# Altium schematic sheet 55. SOC PMIC.SchDoc: PMIC (part 3 of 3)
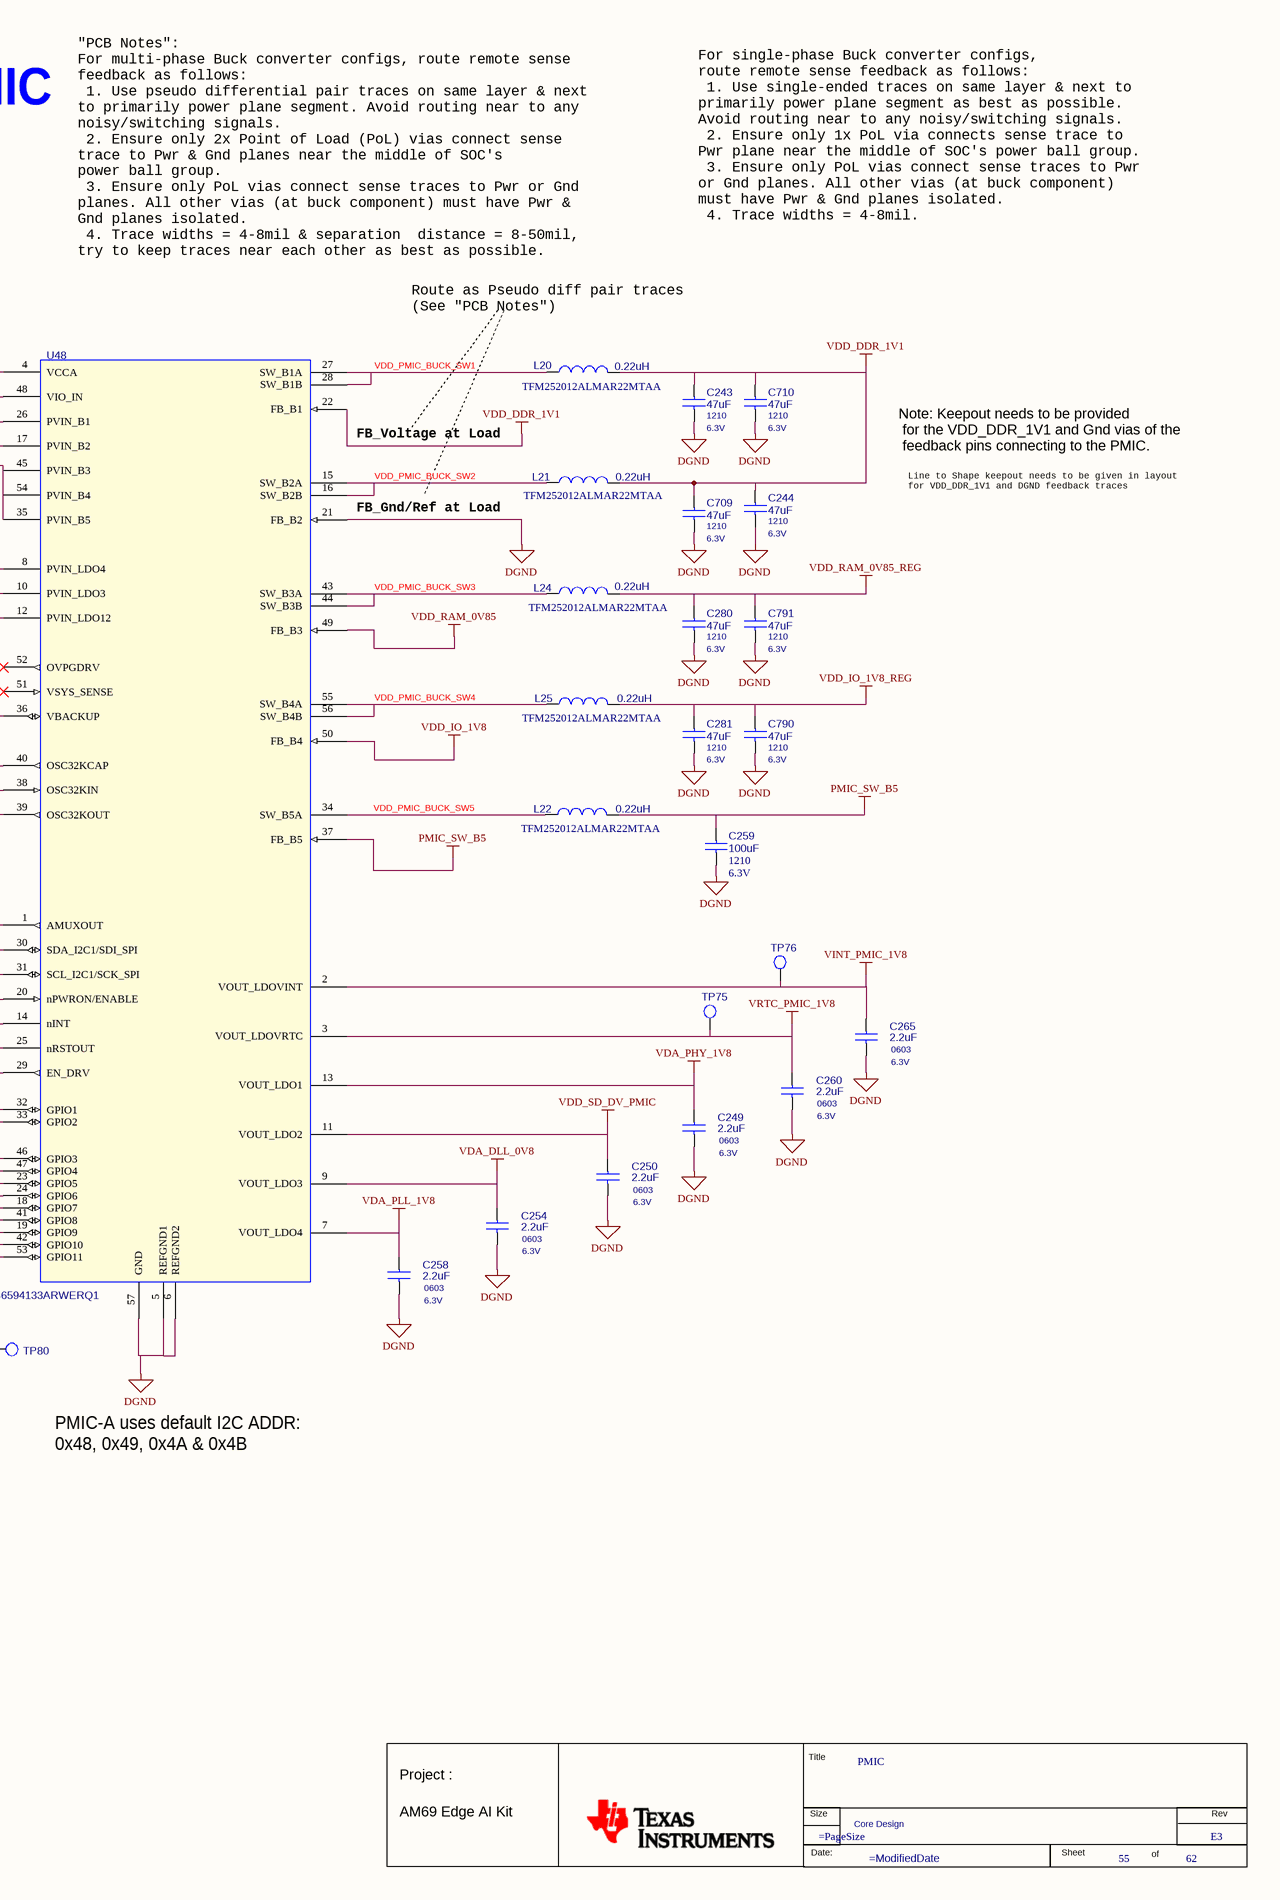
[diagram p3: 55. SOC PMIC.SchDoc, right]

## Library data of the parts (continued)
R251 = RESISTOR_Dup2: RES 1K 1/10W 1% 0402; Part Reference: R251; Part_type: RESISTORS\FIXED; Mfr_part_number: ERJ-2RKF1001X; Mfr_name: PANASONIC-ECG; Mistral Part No: 110009030411-R; Voltage: NA; Project: VOCERA; Customs_HS_Code: 85332119; Custom_Duty: 15%; Value: 1K_1%; PCB Footprint: RES0402_0-5; Footprint Path: Y:\MIS_DATABASE\Library\ALTIUM_TOOL\PCB_FOOTPRINTS\Altium_Footprint_Lib.PcbLib; Crtd /date: MAZHAR/150506; Datasheet: Y:\MIS_DATABASE\DATASHEETS\RESISTORS\PAN-ERJSER_NOV17.PDF; Temperature: -55°C+155°C; Weight: 0.8mg; Height: 0.40MM; Distributor_part_number: P1.00KLCT-ND; Distributor_name: DIGIKEY; Package: 0402; Wattage: 1/10W; Tolerance: 1%; Library Ref: RESISTOR; Footprint Ref: RES0402_0-5; Chkd/date: VASANTHA/281216; MECHANICAL 3D STEP FILE: RES0402_0-5; Library Path: Y:\MIS_DATABASE\Library\ALTIUM_TOOL\SCHEMATICS_PARTS\MS_DISCRETE_Library.schlib; Manufacturer: PANASONIC-ECG
R252 = RESISTOR_Dup2: RES 10K 1/16W 1% 0402; Part Reference: R252; Manufacturer: YAGEO AMERICA; Mistral Part No: 110015090015-R; Mfr_part_number: RC0402FR-0710KL; Part_type: RESISTORS\FIXED; Project: VOCERA; Voltage: NA; Customs_HS_Code: 85332119; Custom_Duty: 15%; Value: 10K_1%; PCB Footprint: RES0402_0-5; Footprint Ref: RES0402_0-5; Mfr_name: YAGEO AMERICA; Tolerance: 1%; Wattage: 1/16W; Distributor_name: DIGIKEY; Distributor_part_number: 311-10.0KLRTR-ND; Library Ref: RESISTOR; Height: 0.40MM; Weight: 0.65mg; Temperature: -55°C+155°C; Datasheet: Y:\MIS_DATABASE\DATASHEETS\RESISTORS\RCXXXXL-SER_MAR18.PDF; Crtd /date: GEETHA/290506; Chkd/date: VASANTHA/201216; MECHANICAL 3D STEP FILE: RES0402_0-5; Library Path: Y:\MIS_DATABASE\Library\ALTIUM_TOOL\SCHEMATICS_PARTS\MS_DISCRETE_Library.schlib; Footprint Path: Y:\MIS_DATABASE\Library\ALTIUM_TOOL\PCB_FOOTPRINTS\Altium_Footprint_Lib.PcbLib
R498 = RESISTOR_Dup2: RES 10K 1/16W 1% 0402; Part Reference: R498; Mistral Part No: 110015090015-R; Mfr_name: YAGEO AMERICA; Mfr_part_number: RC0402FR-0710KL; Part_type: RESISTORS\FIXED; Project: VOCERA; Voltage: NA; Customs_HS_Code: 85332119; Custom_Duty: 15%; Value: 10K_1%; PCB Footprint: RES0402_0-5; Footprint Ref: RES0402_0-5; Tolerance: 1%; Wattage: 1/16W; Distributor_name: DIGIKEY; Distributor_part_number: 311-10.0KLRTR-ND; Library Ref: RESISTOR; Height: 0.40MM; Weight: 0.65mg; Temperature: -55°C+155°C; Datasheet: Y:\MIS_DATABASE\DATASHEETS\RESISTORS\RCXXXXL-SER_MAR18.PDF; Crtd /date: GEETHA/290506; Chkd/date: VASANTHA/201216; MECHANICAL 3D STEP FILE: RES0402_0-5; Library Path: Y:\MIS_DATABASE\Library\ALTIUM_TOOL\SCHEMATICS_PARTS\MS_DISCRETE_Library.schlib; Footprint Path: Y:\MIS_DATABASE\Library\ALTIUM_TOOL\PCB_FOOTPRINTS\Altium_Footprint_Lib.PcbLib; Manufacturer: YAGEO AMERICA
R502 = RESISTOR_Dup2: RES 0E 1/10W JUMPER 0402; Part Reference: R502; Manufacturer: PANASONIC-ECG; Part_type: RESISTORS\FIXED; Mfr_part_number: ERJ-2GE0R00X; Mistral Part No: 110018030052-R; IBISSP_MODLES: VALUE REPEATING 2 TIME; Custom_Duty: 15%; Customs_HS_Code: 85332119; Voltage: NA; Project: AEGIS POM; Value: 0E; Footprint Path: Y:\MIS_DATABASE\Library\ALTIUM_TOOL\PCB_FOOTPRINTS\Altium_Footprint_Lib.PcbLib; MECHANICAL 3D STEP FILE: RES0402_0-5; Chkd/date: VASANTHA/061216; Crtd /date: NAVEED/201014; Datasheet: Y:\MIS_DATABASE\DATASHEETS\RESISTORS\PAN-ERJSER_NOV17.PDF; Temperature: -55°C+155°C; Weight: 0.8mg; Height: 0.40MM; Library Ref: RESISTOR; Distributor_part_number: P0.0JCT-ND; Distributor_name: DIGIKEY; Package: 0402; Wattage: 1/10W; Tolerance: NA; Mfr_name: PANASONIC-ECG; Footprint Ref: RES0402_0-5; Library Path: Y:\MIS_DATABASE\Library\ALTIUM_TOOL\SCHEMATICS_PARTS\MS_DISCRETE_Library.schlib; PCB Footprint: RES0402_0-5
R505 = RESISTOR_Dup2: RES 0E 1/10W JUMPER 0402; Part Reference: R505; Part_type: RESISTORS\FIXED; Mfr_part_number: ERJ-2GE0R00X; Mfr_name: PANASONIC-ECG; Mistral Part No: 110018030052-R; Custom_Duty: 15%; Customs_HS_Code: 85332119; Voltage: NA; Project: AEGIS POM; IBISSP_MODLES: VALUE REPEATING 2 TIME; Value: 0E; Footprint Path: Y:\MIS_DATABASE\Library\ALTIUM_TOOL\PCB_FOOTPRINTS\Altium_Footprint_Lib.PcbLib; MECHANICAL 3D STEP FILE: RES0402_0-5; Chkd/date: VASANTHA/061216; Crtd /date: NAVEED/201014; Datasheet: Y:\MIS_DATABASE\DATASHEETS\RESISTORS\PAN-ERJSER_NOV17.PDF; Temperature: -55°C+155°C; Weight: 0.8mg; Height: 0.40MM; Library Ref: RESISTOR; Distributor_part_number: P0.0JCT-ND; Distributor_name: DIGIKEY; Package: 0402; Wattage: 1/10W; Tolerance: NA; Footprint Ref: RES0402_0-5; Library Path: Y:\MIS_DATABASE\Library\ALTIUM_TOOL\SCHEMATICS_PARTS\MS_DISCRETE_Library.schlib; PCB Footprint: RES0402_0-5; Manufacturer: PANASONIC-ECG
R506 = RESISTOR_Dup2: RES 0E 1/10W JUMPER 0402; Part Reference: R506; Mistral Part No: 110018030052-R; Mfr_name: PANASONIC-ECG; Mfr_part_number: ERJ-2GE0R00X; Part_type: RESISTORS\FIXED; Project: AEGIS POM; Tolerance: NA; Customs_HS_Code: 85332119; Custom_Duty: 15%; IBISSP_MODLES: VALUE REPEATING 2 TIME; Value: 0E; Library Path: Y:\MIS_DATABASE\Library\ALTIUM_TOOL\SCHEMATICS_PARTS\MS_DISCRETE_Library.schlib; Footprint Ref: RES0402_0-5; Voltage: NA; Wattage: 1/10W; Package: 0402; Distributor_name: DIGIKEY; Distributor_part_number: P0.0JCT-ND; Library Ref: RESISTOR; Height: 0.40MM; Weight: 0.8mg; Temperature: -55°C+155°C; Datasheet: Y:\MIS_DATABASE\DATASHEETS\RESISTORS\PAN-ERJSER_NOV17.PDF; Crtd /date: NAVEED/201014; Chkd/date: VASANTHA/061216; MECHANICAL 3D STEP FILE: RES0402_0-5; Footprint Path: Y:\MIS_DATABASE\Library\ALTIUM_TOOL\PCB_FOOTPRINTS\Altium_Footprint_Lib.PcbLib; Manufacturer: PANASONIC-ECG; PCB Footprint: RES0402_0-5
R507 = RESISTOR_Dup2: RES 0E 1/10W JUMPER 0402; Part Reference: R507; Mistral Part No: 110018030052-R; Mfr_name: PANASONIC-ECG; Mfr_part_number: ERJ-2GE0R00X; Part_type: RESISTORS\FIXED; Project: AEGIS POM; Tolerance: NA; Customs_HS_Code: 85332119; Custom_Duty: 15%; IBISSP_MODLES: VALUE REPEATING 2 TIME; Value: 0E; Library Path: Y:\MIS_DATABASE\Library\ALTIUM_TOOL\SCHEMATICS_PARTS\MS_DISCRETE_Library.schlib; Footprint Ref: RES0402_0-5; Voltage: NA; Wattage: 1/10W; Package: 0402; Distributor_name: DIGIKEY; Distributor_part_number: P0.0JCT-ND; Library Ref: RESISTOR; Height: 0.40MM; Weight: 0.8mg; Temperature: -55°C+155°C; Datasheet: Y:\MIS_DATABASE\DATASHEETS\RESISTORS\PAN-ERJSER_NOV17.PDF; Crtd /date: NAVEED/201014; Chkd/date: VASANTHA/061216; MECHANICAL 3D STEP FILE: RES0402_0-5; Footprint Path: Y:\MIS_DATABASE\Library\ALTIUM_TOOL\PCB_FOOTPRINTS\Altium_Footprint_Lib.PcbLib; Manufacturer: PANASONIC-ECG; PCB Footprint: RES0402_0-5
R513 = RESISTOR_Dup2: RES 0E 1/10W JUMPER 0402; Part Reference: R513; Mistral Part No: 110018030052-R; Mfr_name: PANASONIC-ECG; Mfr_part_number: ERJ-2GE0R00X; Part_type: RESISTORS\FIXED; Project: AEGIS POM; Tolerance: NA; Customs_HS_Code: 85332119; Custom_Duty: 15%; IBISSP_MODLES: VALUE REPEATING 2 TIME; Value: 0E; Library Path: Y:\MIS_DATABASE\Library\ALTIUM_TOOL\SCHEMATICS_PARTS\MS_DISCRETE_Library.schlib; Footprint Ref: RES0402_0-5; Voltage: NA; Wattage: 1/10W; Package: 0402; Distributor_name: DIGIKEY; Distributor_part_number: P0.0JCT-ND; Library Ref: RESISTOR; Height: 0.40MM; Weight: 0.8mg; Temperature: -55°C+155°C; Datasheet: Y:\MIS_DATABASE\DATASHEETS\RESISTORS\PAN-ERJSER_NOV17.PDF; Crtd /date: NAVEED/201014; Chkd/date: VASANTHA/061216; MECHANICAL 3D STEP FILE: RES0402_0-5; Footprint Path: Y:\MIS_DATABASE\Library\ALTIUM_TOOL\PCB_FOOTPRINTS\Altium_Footprint_Lib.PcbLib; Manufacturer: PANASONIC-ECG; PCB Footprint: RES0402_0-5
R515 = RESISTOR_Dup2: RES 10K 1/16W 1% 0402; Part Reference: R515; Manufacturer: YAGEO AMERICA; Part_type: RESISTORS\FIXED; Mfr_part_number: RC0402FR-0710KL; Mistral Part No: 110015090015-R; Custom_Duty: 15%; Customs_HS_Code: 85332119; Voltage: NA; Project: VOCERA; Value: 10K_1%; Footprint Path: Y:\MIS_DATABASE\Library\ALTIUM_TOOL\PCB_FOOTPRINTS\Altium_Footprint_Lib.PcbLib; Library Path: Y:\MIS_DATABASE\Library\ALTIUM_TOOL\SCHEMATICS_PARTS\MS_DISCRETE_Library.schlib; MECHANICAL 3D STEP FILE: RES0402_0-5; Chkd/date: VASANTHA/201216; Crtd /date: GEETHA/290506; Datasheet: Y:\MIS_DATABASE\DATASHEETS\RESISTORS\RCXXXXL-SER_MAR18.PDF; Temperature: -55°C+155°C; Weight: 0.65mg; Height: 0.40MM; Library Ref: RESISTOR; Distributor_part_number: 311-10.0KLRTR-ND; Distributor_name: DIGIKEY; Wattage: 1/16W; Tolerance: 1%; Mfr_name: YAGEO AMERICA; Footprint Ref: RES0402_0-5; PCB Footprint: RES0402_0-5
R528 = RESISTOR_Dup2: RES 0E 1/10W JUMPER 0402; Part Reference: R528; Mistral Part No: 110018030052-R; Mfr_name: PANASONIC-ECG; Mfr_part_number: ERJ-2GE0R00X; Part_type: RESISTORS\FIXED; Project: AEGIS POM; Tolerance: NA; Customs_HS_Code: 85332119; Custom_Duty: 15%; IBISSP_MODLES: VALUE REPEATING 2 TIME; Value: 0E; PCB Footprint: RES0402_0-5; Library Path: Y:\MIS_DATABASE\Library\ALTIUM_TOOL\SCHEMATICS_PARTS\MS_DISCRETE_Library.schlib; Footprint Ref: RES0402_0-5; Voltage: NA; Wattage: 1/10W; Distributor_name: DIGIKEY; Distributor_part_number: P0.0JCT-ND; Library Ref: RESISTOR; Height: 0.40MM; Weight: 0.8mg; Temperature: -55°C+155°C; Datasheet: Y:\MIS_DATABASE\DATASHEETS\RESISTORS\PAN-ERJSER_NOV17.PDF; Crtd /date: NAVEED/201014; Chkd/date: VASANTHA/061216; MECHANICAL 3D STEP FILE: RES0402_0-5; Footprint Path: Y:\MIS_DATABASE\Library\ALTIUM_TOOL\PCB_FOOTPRINTS\Altium_Footprint_Lib.PcbLib; Manufacturer: PANASONIC-ECG
R529 = RESISTOR_Dup2: RES 10K 1/16W 1% 0402; Part Reference: R529; Manufacturer: YAGEO AMERICA; Mistral Part No: 110015090015-R; Mfr_part_number: RC0402FR-0710KL; Part_type: RESISTORS\FIXED; Project: VOCERA; Voltage: NA; Customs_HS_Code: 85332119; Custom_Duty: 15%; Value: 10K_1%; PCB Footprint: RES0402_0-5; Footprint Ref: RES0402_0-5; Mfr_name: YAGEO AMERICA; Tolerance: 1%; Wattage: 1/16W; Distributor_name: DIGIKEY; Distributor_part_number: 311-10.0KLRTR-ND; Library Ref: RESISTOR; Height: 0.40MM; Weight: 0.65mg; Temperature: -55°C+155°C; Datasheet: Y:\MIS_DATABASE\DATASHEETS\RESISTORS\RCXXXXL-SER_MAR18.PDF; Crtd /date: GEETHA/290506; Chkd/date: VASANTHA/201216; MECHANICAL 3D STEP FILE: RES0402_0-5; Library Path: Y:\MIS_DATABASE\Library\ALTIUM_TOOL\SCHEMATICS_PARTS\MS_DISCRETE_Library.schlib; Footprint Path: Y:\MIS_DATABASE\Library\ALTIUM_TOOL\PCB_FOOTPRINTS\Altium_Footprint_Lib.PcbLib
R532 = RESISTOR_Dup2: RES 0E 1/10W JUMPER 0402; Part Reference: R532; Part_type: RESISTORS\FIXED; Mfr_part_number: ERJ-2GE0R00X; Mfr_name: PANASONIC-ECG; Mistral Part No: 110018030052-R; Custom_Duty: 15%; Customs_HS_Code: 85332119; Voltage: NA; Project: AEGIS POM; IBISSP_MODLES: VALUE REPEATING 2 TIME; Value: 0E; Footprint Path: Y:\MIS_DATABASE\Library\ALTIUM_TOOL\PCB_FOOTPRINTS\Altium_Footprint_Lib.PcbLib; MECHANICAL 3D STEP FILE: RES0402_0-5; Chkd/date: VASANTHA/061216; Crtd /date: NAVEED/201014; Datasheet: Y:\MIS_DATABASE\DATASHEETS\RESISTORS\PAN-ERJSER_NOV17.PDF; Temperature: -55°C+155°C; Weight: 0.8mg; Height: 0.40MM; Library Ref: RESISTOR; Distributor_part_number: P0.0JCT-ND; Distributor_name: DIGIKEY; Wattage: 1/10W; Tolerance: NA; Footprint Ref: RES0402_0-5; Library Path: Y:\MIS_DATABASE\Library\ALTIUM_TOOL\SCHEMATICS_PARTS\MS_DISCRETE_Library.schlib; Manufacturer: PANASONIC-ECG; PCB Footprint: RES0402_0-5
R540 = RESISTOR_Dup2: RES 0E 1/10W JUMPER 0402; Part Reference: R540; Manufacturer: PANASONIC-ECG; Part_type: RESISTORS\FIXED; Mfr_part_number: ERJ-2GE0R00X; Mistral Part No: 110018030052-R; IBISSP_MODLES: VALUE REPEATING 2 TIME; Custom_Duty: 15%; Customs_HS_Code: 85332119; Voltage: NA; Project: AEGIS POM; Value: 0E; PCB Footprint: RES0402_0-5; Footprint Path: Y:\MIS_DATABASE\Library\ALTIUM_TOOL\PCB_FOOTPRINTS\Altium_Footprint_Lib.PcbLib; MECHANICAL 3D STEP FILE: RES0402_0-5; Chkd/date: VASANTHA/061216; Crtd /date: NAVEED/201014; Datasheet: Y:\MIS_DATABASE\DATASHEETS\RESISTORS\PAN-ERJSER_NOV17.PDF; Temperature: -55°C+155°C; Weight: 0.8mg; Height: 0.40MM; Library Ref: RESISTOR; Distributor_part_number: P0.0JCT-ND; Distributor_name: DIGIKEY; Package: 0402; Wattage: 1/10W; Tolerance: NA; Mfr_name: PANASONIC-ECG; Footprint Ref: RES0402_0-5; Library Path: Y:\MIS_DATABASE\Library\ALTIUM_TOOL\SCHEMATICS_PARTS\MS_DISCRETE_Library.schlib
TP60 = TESTPOINT_Dup1: TESTPOINT CIR 30 SMD; Part Reference: TP60; Mistral Part No: 130009030930; Mfr_name: LOCAL; Project: BT MODULE_CSRBC04; Tolerance: NA; Value: TP30_SMD; Footprint Ref: TP30_SMD; Mfr_part_number: TP30_SMD; Part_type: TESTPOINT; Voltage: NA; Wattage: NA; Package: SMD; Distributor_name: NA; Distributor_part_number: NA; Library Ref: TESTPOINT; Height: NA; Weight: NA; Temperature: NA; Datasheet: NA; Crtd /date: MAZHAR/171006; Chkd/date: SHREESHAIL/171006; RoHS: NA; Customs_HS_Code: NA; Custom_Duty: NA; MECHANICAL 3D STEP FILE: NA; Library Path: Y:\MIS_DATABASE\Library\ALTIUM_TOOL\SCHEMATICS_PARTS\MS_DISCRETE_Library.schlib; Footprint Path: Y:\MIS_DATABASE\Library\ALTIUM_TOOL\PCB_FOOTPRINTS\Altium_Footprint_Lib.PcbLib; PCB Footprint: TP30_SMD; Manufacturer: LOCAL
TP62 = TESTPOINT_Dup1: TESTPOINT CIR 30 SMD; Part Reference: TP62; Manufacturer: LOCAL; Mistral Part No: 130009030930; MECHANICAL 3D STEP FILE: NA; Project: BT MODULE_CSRBC04; Value: TP30_SMD; PCB Footprint: TP30_SMD; Footprint Path: Y:\MIS_DATABASE\Library\ALTIUM_TOOL\PCB_FOOTPRINTS\Altium_Footprint_Lib.PcbLib; Library Path: Y:\MIS_DATABASE\Library\ALTIUM_TOOL\SCHEMATICS_PARTS\MS_DISCRETE_Library.schlib; Custom_Duty: NA; Customs_HS_Code: NA; RoHS: NA; Chkd/date: SHREESHAIL/171006; Crtd /date: MAZHAR/171006; Datasheet: NA; Temperature: NA; Weight: NA; Height: NA; Library Ref: TESTPOINT; Distributor_part_number: NA; Distributor_name: NA; Package: SMD; Wattage: NA; Voltage: NA; Tolerance: NA; Part_type: TESTPOINT; Mfr_part_number: TP30_SMD; Mfr_name: LOCAL; Footprint Ref: TP30_SMD
TP64 = TESTPOINT_Dup1: TESTPOINT CIR 30 SMD; Part Reference: TP64; Manufacturer: LOCAL; Mistral Part No: 130009030930; Project: BT MODULE_CSRBC04; Tolerance: NA; Value: TP30_SMD; Footprint Ref: TP30_SMD; Mfr_name: LOCAL; Mfr_part_number: TP30_SMD; Part_type: TESTPOINT; Voltage: NA; Wattage: NA; Package: SMD; Distributor_name: NA; Distributor_part_number: NA; Library Ref: TESTPOINT; Height: NA; Weight: NA; Temperature: NA; Datasheet: NA; Crtd /date: MAZHAR/171006; Chkd/date: SHREESHAIL/171006; RoHS: NA; Customs_HS_Code: NA; Custom_Duty: NA; MECHANICAL 3D STEP FILE: NA; Library Path: Y:\MIS_DATABASE\Library\ALTIUM_TOOL\SCHEMATICS_PARTS\MS_DISCRETE_Library.schlib; Footprint Path: Y:\MIS_DATABASE\Library\ALTIUM_TOOL\PCB_FOOTPRINTS\Altium_Footprint_Lib.PcbLib; PCB Footprint: TP30_SMD
TP68 = TESTPOINT_Dup1: TESTPOINT CIR 30 SMD; Part Reference: TP68; Mfr_name: LOCAL; Mistral Part No: 130009030930; MECHANICAL 3D STEP FILE: NA; Project: BT MODULE_CSRBC04; Value: TP30_SMD; PCB Footprint: TP30_SMD; RoHS: NA; Footprint Path: Y:\MIS_DATABASE\Library\ALTIUM_TOOL\PCB_FOOTPRINTS\Altium_Footprint_Lib.PcbLib; Library Path: Y:\MIS_DATABASE\Library\ALTIUM_TOOL\SCHEMATICS_PARTS\MS_DISCRETE_Library.schlib; Chkd/date: SHREESHAIL/171006; Crtd /date: MAZHAR/171006; Datasheet: NA; Temperature: NA; Weight: NA; Height: NA; Distributor_part_number: NA; Distributor_name: NA; Package: SMD; Wattage: NA; Voltage: NA; Tolerance: NA; Part_type: TESTPOINT; Mfr_part_number: TP30_SMD; Library Ref: TESTPOINT; Footprint Ref: TP30_SMD; Customs_HS_Code: NA; Custom_Duty: NA; Manufacturer: LOCAL
TP69 = TESTPOINT_Dup1: TESTPOINT CIR 30 SMD; Part Reference: TP69; Mfr_name: LOCAL; Mistral Part No: 130009030930; MECHANICAL 3D STEP FILE: NA; Project: BT MODULE_CSRBC04; Value: TP30_SMD; Footprint Path: Y:\MIS_DATABASE\Library\ALTIUM_TOOL\PCB_FOOTPRINTS\Altium_Footprint_Lib.PcbLib; Library Path: Y:\MIS_DATABASE\Library\ALTIUM_TOOL\SCHEMATICS_PARTS\MS_DISCRETE_Library.schlib; Custom_Duty: NA; Customs_HS_Code: NA; RoHS: NA; Chkd/date: SHREESHAIL/171006; Crtd /date: MAZHAR/171006; Datasheet: NA; Temperature: NA; Weight: NA; Height: NA; Library Ref: TESTPOINT; Distributor_part_number: NA; Distributor_name: NA; Package: SMD; Wattage: NA; Voltage: NA; Tolerance: NA; Part_type: TESTPOINT; Mfr_part_number: TP30_SMD; Footprint Ref: TP30_SMD; Manufacturer: LOCAL; PCB Footprint: TP30_SMD
TP70 = TESTPOINT_Dup1: TESTPOINT CIR 30 SMD; Part Reference: TP70; Manufacturer: LOCAL; Mistral Part No: 130009030930; MECHANICAL 3D STEP FILE: NA; Project: BT MODULE_CSRBC04; Value: TP30_SMD; Footprint Path: Y:\MIS_DATABASE\Library\ALTIUM_TOOL\PCB_FOOTPRINTS\Altium_Footprint_Lib.PcbLib; Library Path: Y:\MIS_DATABASE\Library\ALTIUM_TOOL\SCHEMATICS_PARTS\MS_DISCRETE_Library.schlib; Custom_Duty: NA; Customs_HS_Code: NA; RoHS: NA; Chkd/date: SHREESHAIL/171006; Crtd /date: MAZHAR/171006; Datasheet: NA; Temperature: NA; Weight: NA; Height: NA; Library Ref: TESTPOINT; Distributor_part_number: NA; Distributor_name: NA; Package: SMD; Wattage: NA; Voltage: NA; Tolerance: NA; Part_type: TESTPOINT; Mfr_part_number: TP30_SMD; Mfr_name: LOCAL; Footprint Ref: TP30_SMD; PCB Footprint: TP30_SMD
TP75 = TESTPOINT_Dup1: TESTPOINT CIR 30 SMD; Part Reference: TP75; Mfr_name: LOCAL; Mistral Part No: 130009030930; MECHANICAL 3D STEP FILE: NA; Project: BT MODULE_CSRBC04; Value: TP30_SMD; Footprint Path: Y:\MIS_DATABASE\Library\ALTIUM_TOOL\PCB_FOOTPRINTS\Altium_Footprint_Lib.PcbLib; Library Path: Y:\MIS_DATABASE\Library\ALTIUM_TOOL\SCHEMATICS_PARTS\MS_DISCRETE_Library.schlib; Custom_Duty: NA; Customs_HS_Code: NA; RoHS: NA; Chkd/date: SHREESHAIL/171006; Crtd /date: MAZHAR/171006; Datasheet: NA; Temperature: NA; Weight: NA; Height: NA; Library Ref: TESTPOINT; Distributor_part_number: NA; Distributor_name: NA; Package: SMD; Wattage: NA; Voltage: NA; Tolerance: NA; Part_type: TESTPOINT; Mfr_part_number: TP30_SMD; Footprint Ref: TP30_SMD; PCB Footprint: TP30_SMD; Manufacturer: LOCAL
TP76 = TESTPOINT_Dup1: TESTPOINT CIR 30 SMD; Part Reference: TP76; Mistral Part No: 130009030930; Mfr_name: LOCAL; Project: BT MODULE_CSRBC04; Tolerance: NA; Value: TP30_SMD; Footprint Ref: TP30_SMD; Mfr_part_number: TP30_SMD; Part_type: TESTPOINT; Voltage: NA; Wattage: NA; Package: SMD; Distributor_name: NA; Distributor_part_number: NA; Library Ref: TESTPOINT; Height: NA; Weight: NA; Temperature: NA; Datasheet: NA; Crtd /date: MAZHAR/171006; Chkd/date: SHREESHAIL/171006; RoHS: NA; Customs_HS_Code: NA; Custom_Duty: NA; MECHANICAL 3D STEP FILE: NA; Library Path: Y:\MIS_DATABASE\Library\ALTIUM_TOOL\SCHEMATICS_PARTS\MS_DISCRETE_Library.schlib; Footprint Path: Y:\MIS_DATABASE\Library\ALTIUM_TOOL\PCB_FOOTPRINTS\Altium_Footprint_Lib.PcbLib; PCB Footprint: TP30_SMD; Manufacturer: LOCAL
TP78 = TESTPOINT_Dup1: TESTPOINT CIR 30 SMD; Part Reference: TP78; Manufacturer: LOCAL; Mistral Part No: 130009030930; Custom_Duty: NA; Project: BT MODULE_CSRBC04; Value: TP30_SMD; PCB Footprint: TP30_SMD; Customs_HS_Code: NA; Footprint Ref: TP30_SMD; Library Ref: TESTPOINT; Mfr_name: LOCAL; Mfr_part_number: TP30_SMD; Part_type: TESTPOINT; Tolerance: NA; Voltage: NA; Wattage: NA; Package: SMD; Distributor_name: NA; Distributor_part_number: NA; Height: NA; Weight: NA; Temperature: NA; Datasheet: NA; Crtd /date: MAZHAR/171006; Chkd/date: SHREESHAIL/171006; MECHANICAL 3D STEP FILE: NA; Library Path: Y:\MIS_DATABASE\Library\ALTIUM_TOOL\SCHEMATICS_PARTS\MS_DISCRETE_Library.schlib; Footprint Path: Y:\MIS_DATABASE\Library\ALTIUM_TOOL\PCB_FOOTPRINTS\Altium_Footprint_Lib.PcbLib; RoHS: NA
TP79 = TESTPOINT_Dup1: TESTPOINT CIR 30 SMD; Part Reference: TP79; Manufacturer: LOCAL; Mistral Part No: 130009030930; Project: BT MODULE_CSRBC04; Tolerance: NA; Value: TP30_SMD; PCB Footprint: TP30_SMD; Footprint Ref: TP30_SMD; Mfr_name: LOCAL; Mfr_part_number: TP30_SMD; Part_type: TESTPOINT; Voltage: NA; Wattage: NA; Package: SMD; Distributor_name: NA; Distributor_part_number: NA; Library Ref: TESTPOINT; Height: NA; Weight: NA; Temperature: NA; Datasheet: NA; Crtd /date: MAZHAR/171006; Chkd/date: SHREESHAIL/171006; RoHS: NA; Customs_HS_Code: NA; Custom_Duty: NA; MECHANICAL 3D STEP FILE: NA; Library Path: Y:\MIS_DATABASE\Library\ALTIUM_TOOL\SCHEMATICS_PARTS\MS_DISCRETE_Library.schlib; Footprint Path: Y:\MIS_DATABASE\Library\ALTIUM_TOOL\PCB_FOOTPRINTS\Altium_Footprint_Lib.PcbLib
TP80 = TESTPOINT_Dup1: TESTPOINT CIR 30 SMD; Part Reference: TP80; Mistral Part No: 130009030930; Mfr_name: LOCAL; Project: BT MODULE_CSRBC04; Tolerance: NA; Value: TP30_SMD; Footprint Ref: TP30_SMD; Mfr_part_number: TP30_SMD; Part_type: TESTPOINT; Voltage: NA; Wattage: NA; Package: SMD; Distributor_name: NA; Distributor_part_number: NA; Library Ref: TESTPOINT; Height: NA; Weight: NA; Temperature: NA; Datasheet: NA; Crtd /date: MAZHAR/171006; Chkd/date: SHREESHAIL/171006; RoHS: NA; Customs_HS_Code: NA; Custom_Duty: NA; MECHANICAL 3D STEP FILE: NA; Library Path: Y:\MIS_DATABASE\Library\ALTIUM_TOOL\SCHEMATICS_PARTS\MS_DISCRETE_Library.schlib; Footprint Path: Y:\MIS_DATABASE\Library\ALTIUM_TOOL\PCB_FOOTPRINTS\Altium_Footprint_Lib.PcbLib; PCB Footprint: TP30_SMD; Manufacturer: LOCAL
U48 = TPS65941-Q1_VQFN56: IC POWER MANAGEMENT WITH 4-PHASE 14A BUCK VQFN56; Part Reference: U48; Manufacturer: TEXAS INSTRUMENTS; Mistral Part No: 142022030021-R; Part_type: ICS\POWER\MANAGEMENT; PCB Footprint: VQFN56_19-68_320X320_0-9_EP6; Remarks: CREATED SAME AS PTPS65941120RWERQ1; Project: TI_J7AHP_EVM_BRD; Tolerance: NA; Customs_HS_Code: 85423100; Custom_Duty: 15%; Value: TPS6594133ARWERQ1; Footprint Ref: VQFN56_19-68_320X320_0-9_EP6; Mfr_name: TEXAS INSTRUMENTS; Mfr_part_number: TPS6594133ARWERQ1; Voltage: NA; Wattage: NA; Package: VQFN56; Distributor_name: NA; Distributor_part_number: NA; Library Ref: TPS65941-Q1_VQFN56; Height: 0.90MM; Weight: NA; Temperature: -40°C+125°C; Datasheet: Y:\MIS_DATABASE\DATASHEETS\ICS\POWER\TPS65941-Q1.PDF; Crtd /date: ALVY/280322; Chkd/date: ALVY/280322; MECHANICAL 3D STEP FILE: VQFN56_19-68_320X320_0-9_EP6; Library Path: Y:\MIS_DATABASE\Library\ALTIUM_TOOL\SCHEMATICS_PARTS\MS_MISCPOWER_Library.schlib; Footprint Path: Y:\MIS_DATABASE\Library\ALTIUM_TOOL\PCB_FOOTPRINTS\Altium_Footprint_Lib.PcbLib
Y6 = CRY: CRY 32.768KHz 9pF SMD; Part Reference: Y6; Part_type: CRYSTAL; Mfr_name: ECS INC; Mistral Part No: 130019040003-R; Custom_Duty: 24%; Customs_HS_Code: 85439000; Wattage: NA; Project: J7ES_SOM_DUAL-LEO_PMIC; Value: 32.768KHz; Footprint Path: Y:\MIS_DATABASE\Library\ALTIUM_TOOL\PCB_FOOTPRINTS\Altium_Footprint_Lib.PcbLib; Library Path: Y:\MIS_DATABASE\Library\ALTIUM_TOOL\SCHEMATICS_PARTS\MS_DISCRETE_Library.schlib; MECHANICAL 3D STEP FILE: XTAL_ECS-32_130X60_SMD_0-9; Footprint Ref: XTAL_ECS-32_130X60_SMD_0-9; Chkd/date: VASANTHA/090419; Crtd /date: ALVY/090419; Datasheet: Y:\MIS_DATABASE\DATASHEETS\MISC\CRY_OSC\ECS-34Q.PDF; Temperature: -40°C+125°C; Weight: 16mg; Height: 0.90MM; Library Ref: CRY; Distributor_part_number: XC2160CT-ND; Distributor_name: DIGIKEY; Package: SMD; Voltage: NA; Tolerance: NA; PCB Footprint: XTAL_ECS-32_130X60_SMD_0-9; Manufacturer: ECS INC